# EAGLE design Strombegrenzung_RevC (EAGLE 7.6.0)
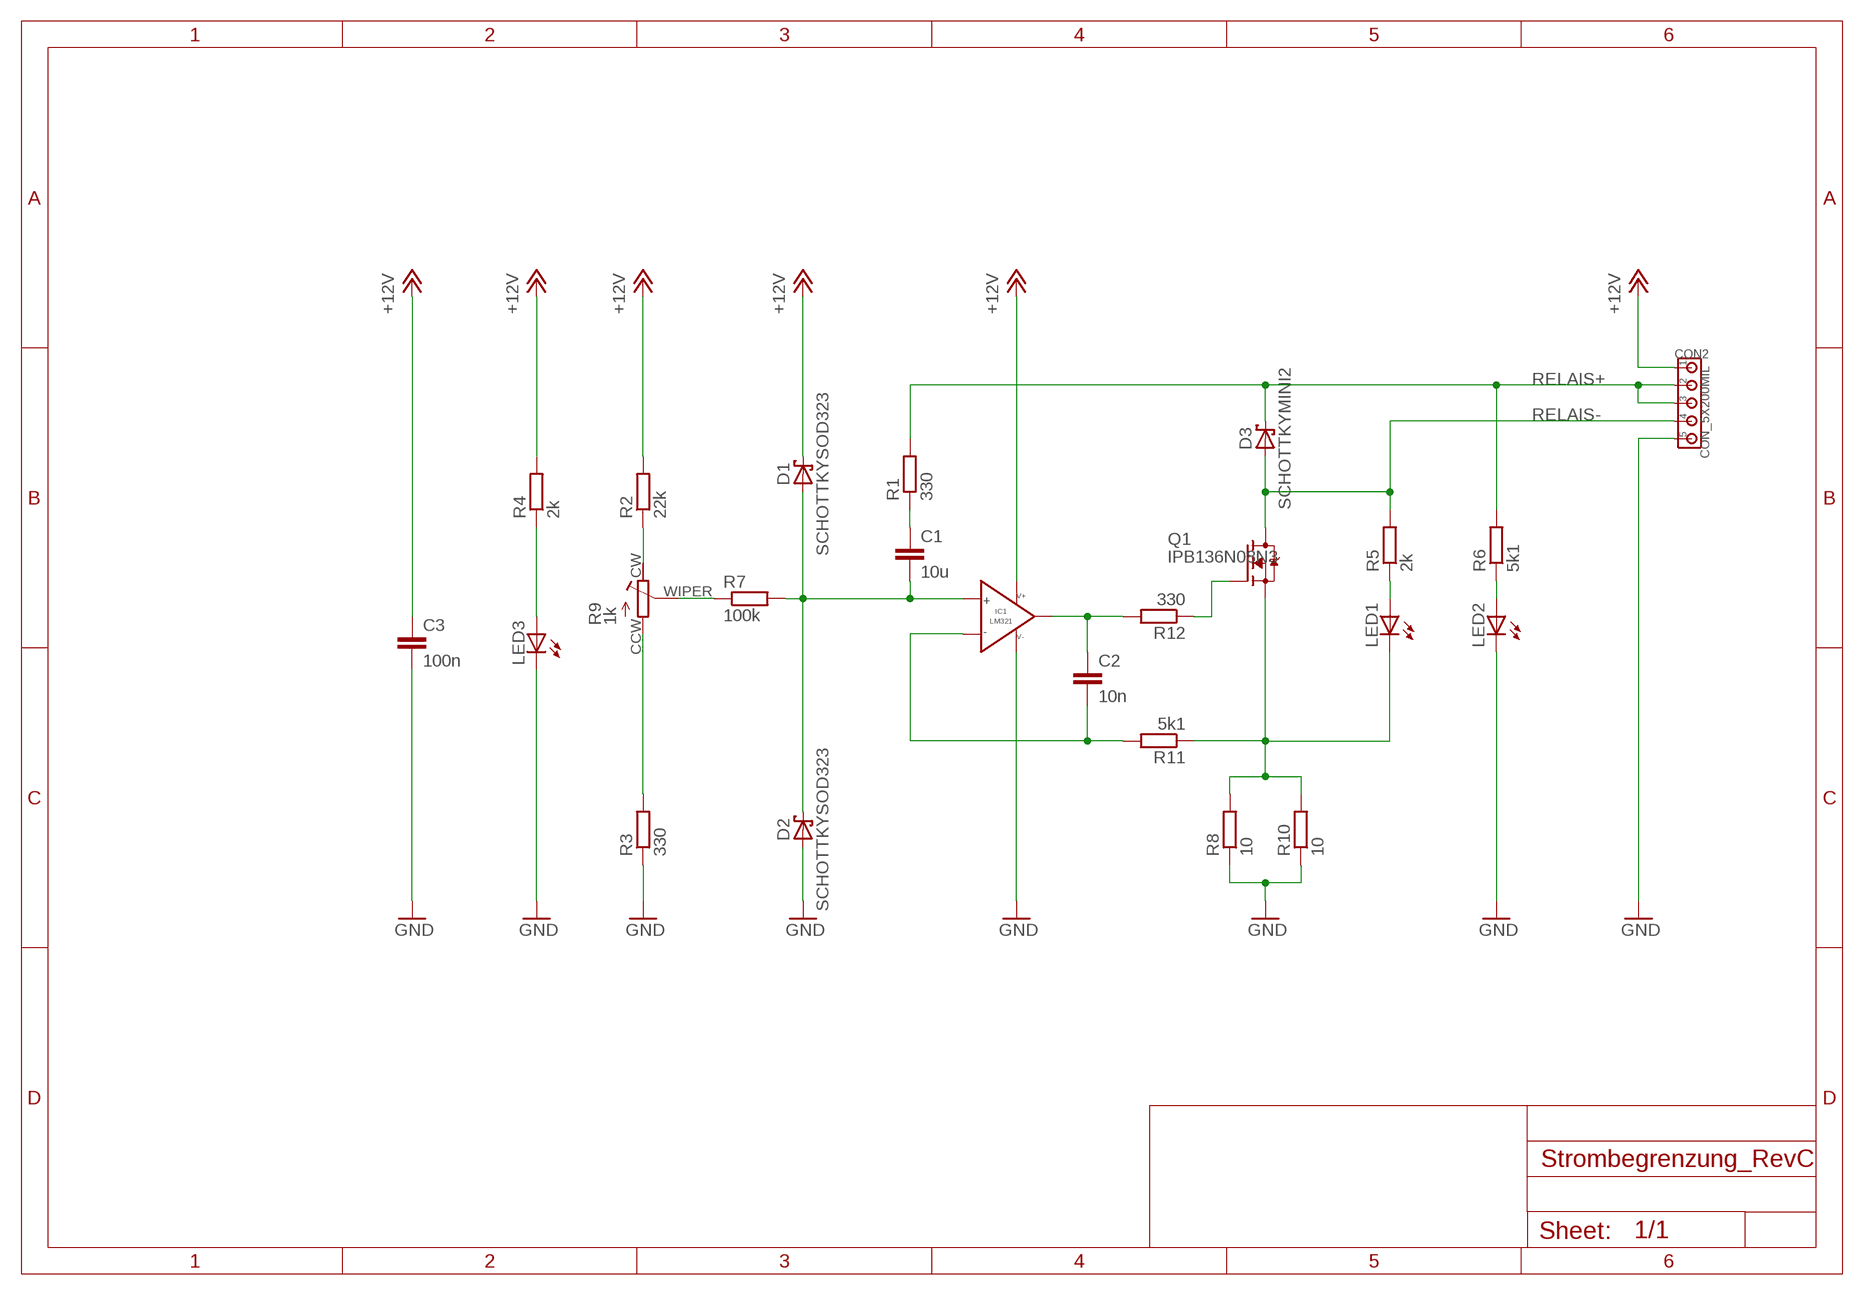
[diagram p0: schematic, sheet 1]

## Parts
C1  10u  CC1206  [C1206]
C2  10n  CC0805  [C0805]
C3  100n  CC0805  [C0805]
CON2  CON_5X200MIL  [200MIL_5X]
D1  SCHOTTKYSOD323  [SOD323]
D2  SCHOTTKYSOD323  [SOD323]
D3  SCHOTTKYMINI2  [MINI2-F3-B]
IC1  LM321  [SOT-23-5]
LED1  LED0805  [LED0805]
LED2  LED0805  [LED0805]
LED3  LED0805  [LED0805]
Q1  IPB136N08N3  N-PWR-MOSFETTO263-3  [TO263-3]
R1  330  RESISTORR0805  [R0805]
R2  22k  RESISTORR0805  [R0805]
R3  330  RESISTORR0805  [R0805]
R4  2k  RESISTORR0805  [R0805]
R5  2k  RESISTORR0805  [R0805]
R6  5k1  RESISTORR0805  [R0805]
R7  100k  RESISTORR0805  [R0805]
R8  10  RESISTORR0805  [R0805]
R9  1k  TRIMMER3314G  [RTRIM3314G]
R10  10  RESISTORR0805  [R0805]
R11  5k1  RESISTORR0805  [R0805]
R12  330  RESISTORR0805  [R0805]

## Nets
+12V: C3.1 CON2.1 D1.C IC1.5(V+) R2.2 R4.2
GND: C3.2 CON2.5 D2.A IC1.2(V-) LED2.C LED3.C R3.1 R8.1 R10.1
N$1: C1.1 R1.1
N$2: R7.1 R9.WIPER
N$3: C1.2 D1.A D2.C IC1.1(IN+) R7.2
N$4: Q1.1(G) R12.1
N$5: LED1.A R5.1
N$6: LED3.A R4.1
N$7: C2.2 IC1.3(IN-) R11.2
N$8: R2.1 R9.CW
N$9: R3.2 R9.CCW
N$10: C2.1 IC1.4(VOUT) R12.2
N$20: LED1.C Q1.3(S) R8.2 R10.2 R11.1
R6: LED2.A R6.1
RELAIS+: CON2.2 CON2.3 D3.C R1.2 R6.2
RELAIS-: CON2.4 D3.A Q1.TAB(D) R5.2

## Library data of the parts
C1-C3 = 00Capacitor:C: Capacitor
CON2 = 00Connector:CON_5X: 5-pin header
D1-D3 = 00Diode:SCHOTTKY
IC1 = 00OpAmp:LM321: LM321 Low Power Single Operational Amplifier 3-32V
LED1-LED3 = 00Display:LED: LED
Q1 = 00Mosfet:N-PWR-MOSFET
R1-R8 R10-R12 = 00Resistor:RESISTOR: RESISTOR, European symbol
R9 = 00Resistor:TRIMMER

## Board
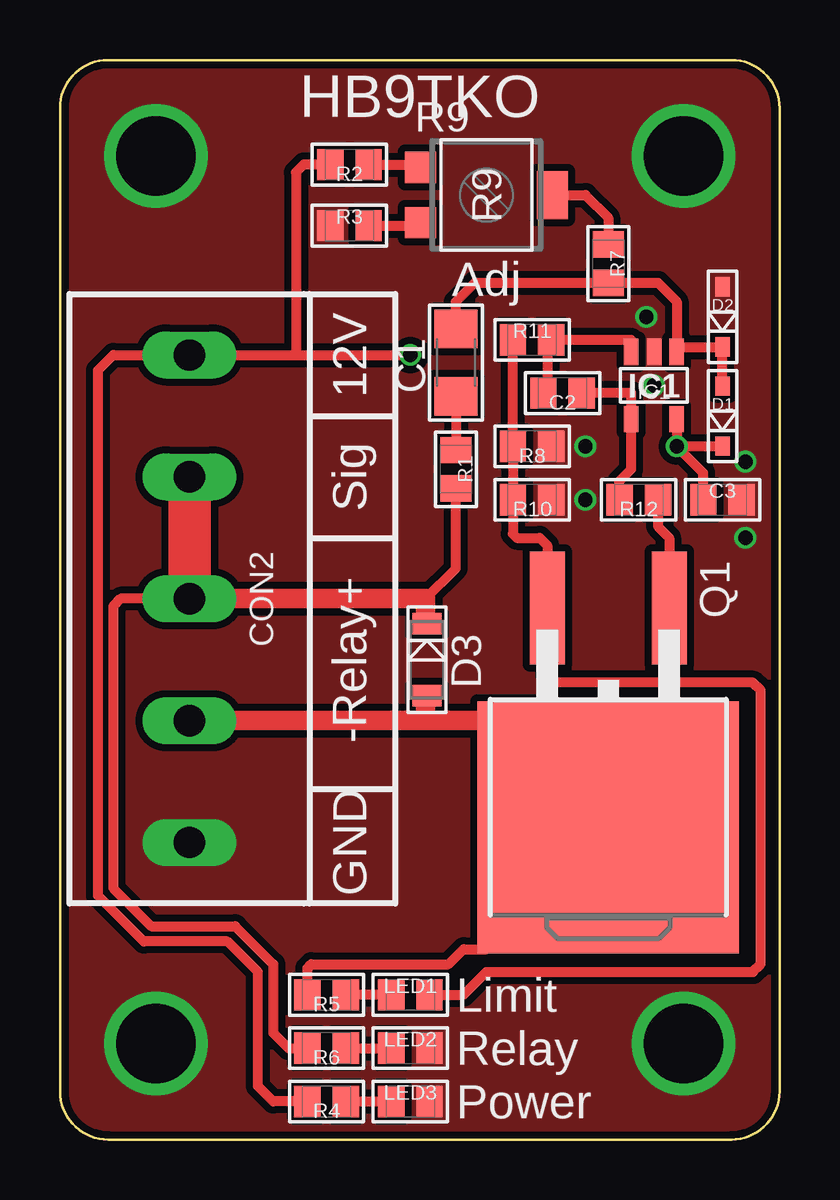
[diagram p1: board, top side]
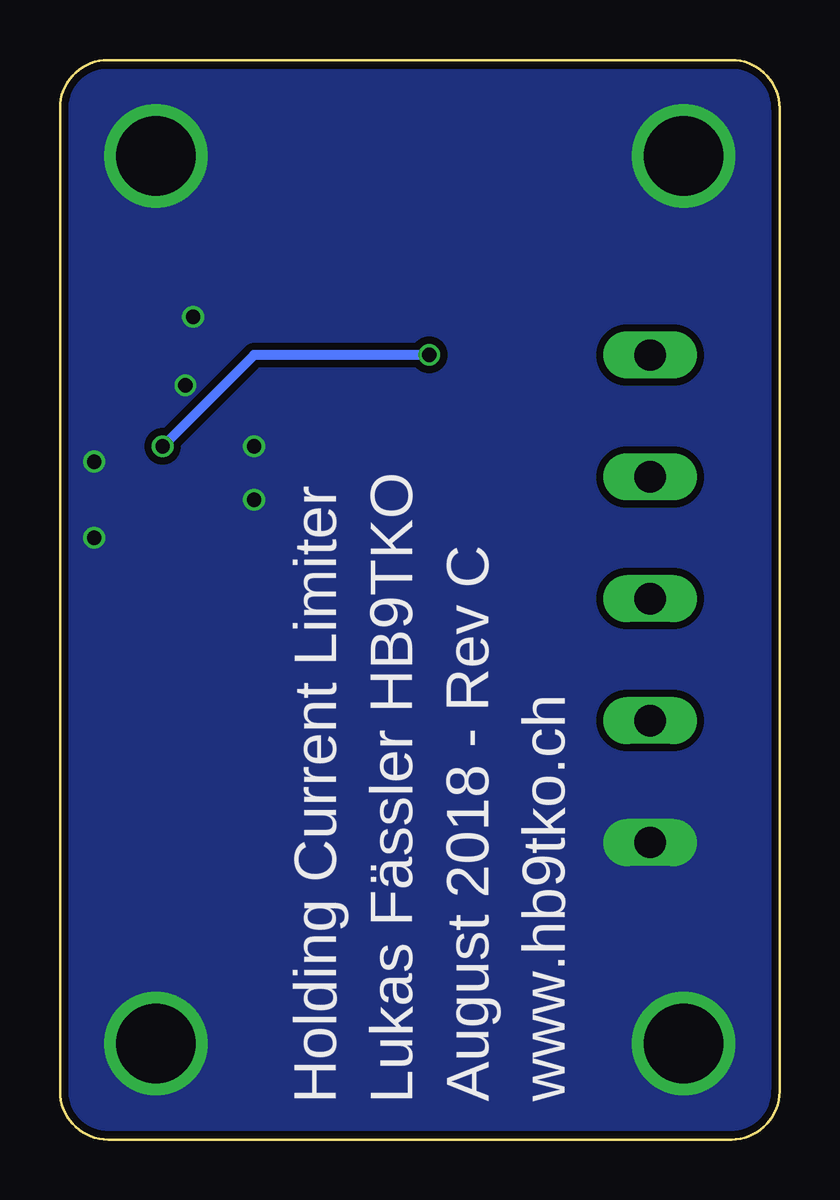
[diagram p2: board, bottom side, seen from below]

Size 30 x 45 mm. Coordinates in mm from the lower left corner, seen from the top.
Outline: 2,0 28,0 arc90 30,2 30,43 arc90 28,45 2,45 arc90 0,43 0,2 arc90 2,0
Copper layers (1*16): Top 0.035mm / dielectric 1.5mm / Bottom 0.035mm
Design rules "dirt_cheap_dirty_boards.8mil": minimum track width 5mil, minimum drill 12mil, track to track 8mil, track to pad 8mil, pad to pad 8mil, via to via 8mil, smd to smd 0mil, copper to edge 10mil, drill to drill 10mil, minimum pad ring 8mil, minimum via ring 6mil, stop-mask expansion 2mil, vias tented up to drill 25mil, thermal gap 10mil

### Footprints (pad centres in the part's own frame; a part is rotated, then mirrored left to right if it is on the bottom)
C1206 = smd 1.6 x 1.8: 1 -1.4,0; 2 1.4,0
C0805 = smd 1.1 x 1.3: 1 -0.8,0; 2 0.8,0
200MIL_5X = drill 1.3 long: 1 -10.16,0; 2 -5.08,0; 3 0,0; 4 5.08,0; 5 10.16,0
SOD323 = smd 0.8 x 0.6: A 1.25,0; C -1.25,0
MINI2-F3-B = smd 0.9 x 1.2: A 1.5,0; C -1.5,0
SOT-23-5 = smd 0.6 x 1.1: 1 -0.95,-1.4; 2 0,-1.4; 3 0.95,-1.4; 4 0.95,1.4; 5 -0.95,1.4
LED0805 = smd 1.1 x 1.3: A -0.8,0; C 0.8,0
TO263-3 = smd 1.45 x 4.7: 1 -2.54,-5.65; 3 2.54,-5.65 | smd 10.9 x 10.5: TAB 0,3.5
R0805 = smd 1.1 x 1.3: 1 -0.8,0; 2 0.8,0
RTRIM3314G = smd 1.3 x 1.3: CCW 1.15,-2.75; CW -1.15,-2.75 | smd 2 x 1.3: WIPER 0,2.75

### Placement (x,y rotation side)
C1  16.51,32.38 90 top
C2  20.95,31.11 180 top
C3  27.62,26.67 0 top
CON2  5.4,22.54 270 top
D1  27.62,30.16 90 top
D2  27.62,34.29 90 top
D3  15.3,20 270 top
IC1  24.77,31.43 180 top
LED1  14.61,6.03 0 top
LED2  14.61,3.81 0 top
LED3  14.61,1.59 0 top
Q1  22.86,16.51 180 top
R1  16.51,27.94 270 top
R2  12.06,40.64 180 top
R3  12.06,38.1 0 top
R4  11.11,1.59 180 top
R5  11.11,6.03 180 top
R6  11.11,3.81 180 top
R7  22.86,36.51 270 top
R8  19.68,28.89 180 top
R9  17.78,39.37 270 top
R10  19.68,26.67 180 top
R11  19.68,33.34 0 top
R12  24.13,26.67 180 top

### Tracks (layer width: path | path; a pad name or v marks a point on that pad's centre or on a via)
+12V  (via drill 0.6)
  Top 0.406: R4.2 8.89,1.59 8.26,2.22 8.26,6.99 6.99,8.26 3.49,8.26 1.59,10.16 1.59,32.07 2.22,32.7 CON2.1 9.84,32.7 | 9.84,32.7 v14.61,32.7 | IC1.5 v25.72,28.89 | v25.72,28.89 25.74,28.91 D1.C | R2.2 10.16,40.64 9.84,40.32 9.84,32.7 | C3.1 26.82,27.79 v25.72,28.89
  Bottom 0.406: v25.72,28.89 21.91,32.7 v14.61,32.7
GND  (via drill 0.6, 3.3)
  other vias: 21.91,28.89 21.91,26.67 24.77,31.43 4,41 26,41 26,4 4,4 24.45,34.29 28.57,28.26 28.57,25.08
  pour Top (isolate 0.3, no thermals): 0,2 0,43 arc-90 2,45 28,45 arc-90 30,43 30,2 arc-90 28,0 2,0 arc-90
  pour Bottom (isolate 0.305, no thermals): 0,40 0,43 arc-90 2,45 15,45 28,45 arc-90 30,43 30,25 30,2 arc-90 28,0 15,0 2,0 arc-90 0,2
N$1
  Top 0.406: C1.1 R1.1
N$2
  Top 0.406: R9.WIPER 21.91,39.37 22.86,38.42 R7.1
N$3
  Top 0.406: D1.A D2.C 25.92,33.04 IC1.1 25.72,34.92 24.93,35.71 R7.2 17.3,35.71 16.51,34.92 C1.2
N$4
  Top 0.406: R12.1 24.93,25.55 25.4,25.08 Q1.1
N$5
  Top 0.406: LED1.A R5.1
N$6
  Top 0.406: R4.1 LED3.A
N$7
  Top 0.406: C2.2 20.32,31.11 20.32,33.34 R11.2 23.81,33.34 IC1.3
N$8
  Top 0.406: R2.1 14.91,40.64 R9.CW
N$9
  Top 0.406: R3.2 14.91,38.1 R9.CCW
N$10
  Top 0.406: C2.1 23.82,31.11 IC1.4 23.81,27.94 23.33,27.46 R12.2
N$20
  Top 0.406: R11.1 R8.2 R10.2 18.89,25.25 19.05,25.08 20,25.08 20.32,24.77 Q1.3 20.32,19.37 20.64,19.05 28.89,19.05 29.21,18.73 29.21,7.3 28.89,6.99 17.78,6.99 16.83,6.03 LED1.C
R6
  Top 0.406: R6.1 LED2.A
RELAIS+
  Top 0.406: CON2.3 2.54,22.54 2.22,22.23 2.22,10.48 3.81,8.89 7.3,8.89 8.89,7.3 8.89,4.45 9.53,3.81 R6.2 | 15.24,22.54 16.51,23.81 R1.2
  Top 0.61: 15.24,21.56 D3.C
  Top 0.813: CON2.3 15.24,22.54 15.24,21.56
  Top 1.778: CON2.2 CON2.3
RELAIS-
  Top 0.406: 10.31,17.3 10.48,17.46 | R5.2 10.31,7.14 10.48,7.3 16.19,7.3 16.83,7.94 17.78,7.94 17.78,10.48 21.59,14.28
  Top 0.61: 15.24,18.44 D3.A
  Top 0.813: CON2.4 10.48,17.46 15.24,17.46 | 15.24,17.46 15.24,18.44 | 15.24,17.46 18.41,17.46 21.59,14.28 Q1.TAB

### Text on the board
tPlace: HB9TKO | Adj | 12V | Sig | -Relay+ | GND | Limit | Relay | Power
bPlace: www.hb9tko.ch | August 2018 - Rev C | Lukas Fässler HB9TKO | Holding Current Limiter